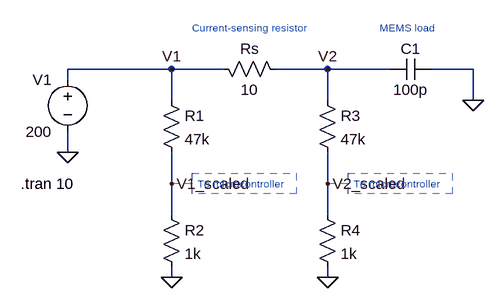
[diagram p0: schematic DC current measurement + protection_simplified.asc]
DC current measurement + protection_simplified.asc, the LTspice schematic file:
Version 4
SHEET 1 880 680
WIRE 112 80 -48 80
WIRE 192 80 112 80
WIRE 352 80 272 80
WIRE 448 80 352 80
WIRE 576 80 512 80
WIRE -48 96 -48 80
WIRE 112 128 112 80
WIRE 352 128 352 80
WIRE 576 128 576 80
WIRE -48 208 -48 176
WIRE 112 256 112 208
WIRE 352 256 352 208
WIRE 112 304 112 256
WIRE 352 304 352 256
WIRE 112 400 112 384
WIRE 352 400 352 384
FLAG -48 208 0
FLAG 112 80 V1
FLAG 352 80 V2
FLAG 112 400 0
FLAG 352 400 0
FLAG 576 128 0
FLAG 352 256 V2_scaled
FLAG 112 256 V1_scaled
SYMBOL voltage -48 80 M0
WINDOW 123 0 0 Left 0
WINDOW 39 0 0 Left 0
SYMATTR InstName V1
SYMATTR Value 200
SYMBOL res 176 64 M90
WINDOW 0 0 56 VBottom 2
WINDOW 3 32 56 VTop 2
SYMATTR InstName Rs
SYMATTR Value 10
SYMBOL res 96 112 R0
SYMATTR InstName R1
SYMATTR Value 47k
SYMBOL res 96 288 R0
SYMATTR InstName R2
SYMATTR Value 1k
SYMBOL res 336 112 R0
SYMATTR InstName R3
SYMATTR Value 47k
SYMBOL res 336 288 R0
SYMATTR InstName R4
SYMATTR Value 1k
SYMBOL cap 512 64 R90
WINDOW 0 0 32 VBottom 2
WINDOW 3 32 32 VTop 2
SYMATTR InstName C1
SYMATTR Value 100p
TEXT -120 256 Left 2 !.tran 10
TEXT 152 256 Left 1 ;To microcontroller
TEXT 144 16 Left 1 ;Current-sensing resistor
TEXT 432 16 Left 1 ;MEMS load
TEXT 392 256 Left 1 ;To microcontroller
LINE Normal 144 256 112 256 2
LINE Normal 384 256 352 256 2
RECTANGLE Normal 304 272 144 240 2
RECTANGLE Normal 544 272 384 240 2

The netlist it stands for:
* DC current measurement + protection_simplified.asc
V1 V1 0 200
Rs V1 V2 10
R1 V1 V1_scaled 47k
R2 V1_scaled 0 1k
R3 V2 V2_scaled 47k
R4 V2_scaled 0 1k
C1 0 V2 100p
.tran 10
* To microcontroller
* Current-sensing resistor
* MEMS load
* To microcontroller
.backanno
.end